# EAGLE schematic power_adc_module (EAGLE 9.5.2)
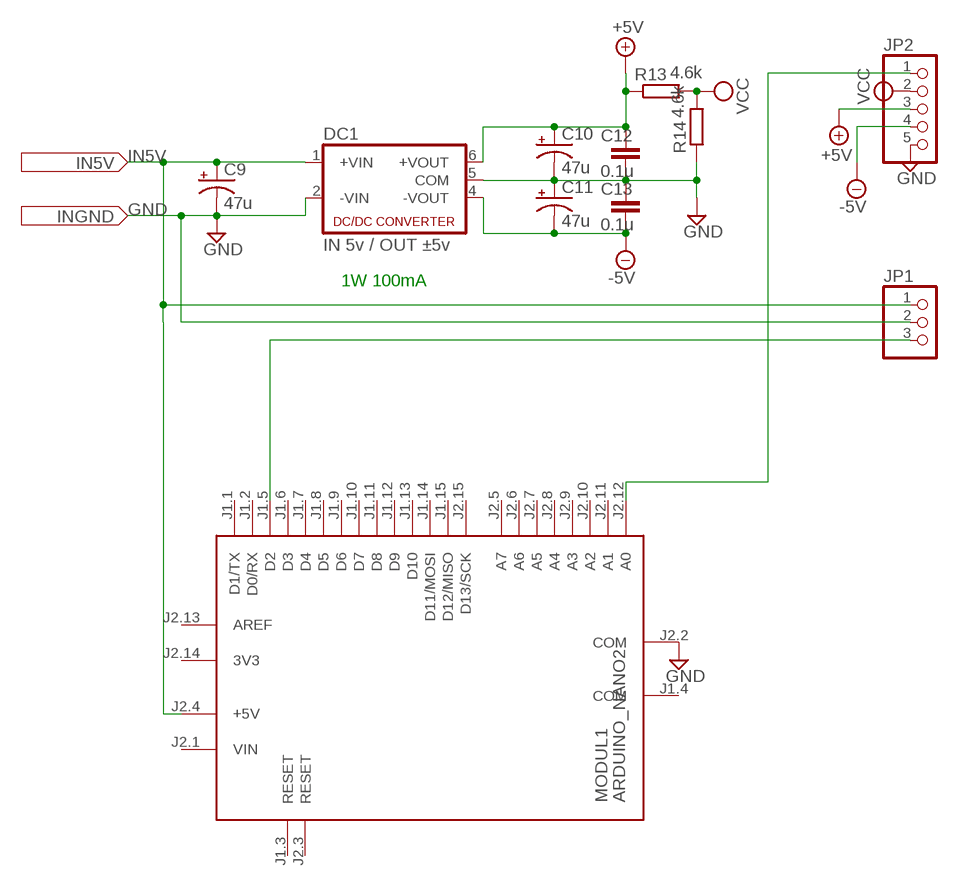
[diagram p0: schematic, sheet 1]

## Parts
C9  47u  CPOL-USE2.5-5  [E2,5-5]
C10  47u  CPOL-USE2.5-5  [E2,5-5]
C11  47u  CPOL-USE2.5-5  [E2,5-5]
C12  0.1u  C-EU025-024X044  [C025-024X044]
C13  0.1u  C-EU025-024X044  [C025-024X044]
DC1  IN 5v / OUT ±5v  NMA  [NMA]
JP1  PINHD-1X3  [1X03]
JP2  PINHD-1X5  [1X05]
MODUL1  ARDUINO_NANO2  [ARDUINO_NANO2]
R13  4.6k  R-EU_0204/7  [0204/7]
R14  4.6k  R-EU_0204/7  [0204/7]

## Nets
+5V: C10.+ C12.1 DC1.6(+VOUT) JP2.3 R13.1
-5V: C11.- C13.2 DC1.4(-VOUT) JP2.4
GND: C9.- C10.- C11.+ C12.2 C13.1 DC1.2(-VIN) DC1.5(COM) JP1.2 JP2.5 MODUL1.J2.2(COM) R14.1
IN5V: C9.+ DC1.1(+VIN) JP1.1 MODUL1.J2.4(+5V)
N$1: JP2.1 MODUL1.J2.12(A0)
N$3: JP1.3 MODUL1.J1.5(D2)
VCC: JP2.2 R13.2 R14.2
Unconnected: MODUL1.J1.1(D1/TX) MODUL1.J1.2(D0/RX) MODUL1.J1.3(RESET) MODUL1.J1.6(D3) MODUL1.J1.7(D4) MODUL1.J1.8(D5) MODUL1.J1.9(D6) MODUL1.J1.10(D7) MODUL1.J1.11(D8) MODUL1.J1.12(D9) MODUL1.J1.13(D10) MODUL1.J1.14(D11/MOSI) MODUL1.J1.15(D12/MISO) MODUL1.J2.3(RESET) MODUL1.J2.5(A7) MODUL1.J2.6(A6) MODUL1.J2.7(A5) MODUL1.J2.8(A4) MODUL1.J2.9(A3) MODUL1.J2.10(A2) MODUL1.J2.11(A1) MODUL1.J2.15(D13/SCK)

## Notes on the sheet
- 1W 100mA

## Power pins joined to a net without a drawn wire
3V3: MODUL1.J2.14(3V3)
AREF: MODUL1.J2.13(AREF)
COM: MODUL1.J1.4(COM)
VIN: MODUL1.J2.1(VIN)

## Library data of the parts
C9-C11 = rcl:CPOL-US: POLARIZED CAPACITOR, American symbol; SPICEPREFIX: C
C12 C13 = rcl:C-EU: CAPACITOR, European symbol; SPICEPREFIX: C
DC1 = dc-dc-converter:NMA: DC-DC CONVERTER; MF: C & D TECHNOLOGIES, INC; MPN: NMA0515SC; OC_FARNELL: 1021434; OC_NEWARK: 61K3064
JP1 = pinhead:PINHD-1X3: PIN HEADER
JP2 = pinhead:PINHD-1X5: PIN HEADER
MODUL1 = arduino:ARDUINO_NANO2: Arduino Nano2 Auto generated by modulcreator.ulp \;; ANZAHL: 2; MODUL: TRUE; STECKX0: -76200; STECKX1: 76200; STECKY0: 177800; STECKY1: 177800
R13 R14 = rcl:R-EU_: RESISTOR, European symbol; SPICEPREFIX: R

## Net classes
0 default: width 1.27 mm, clearance 0.381 mm